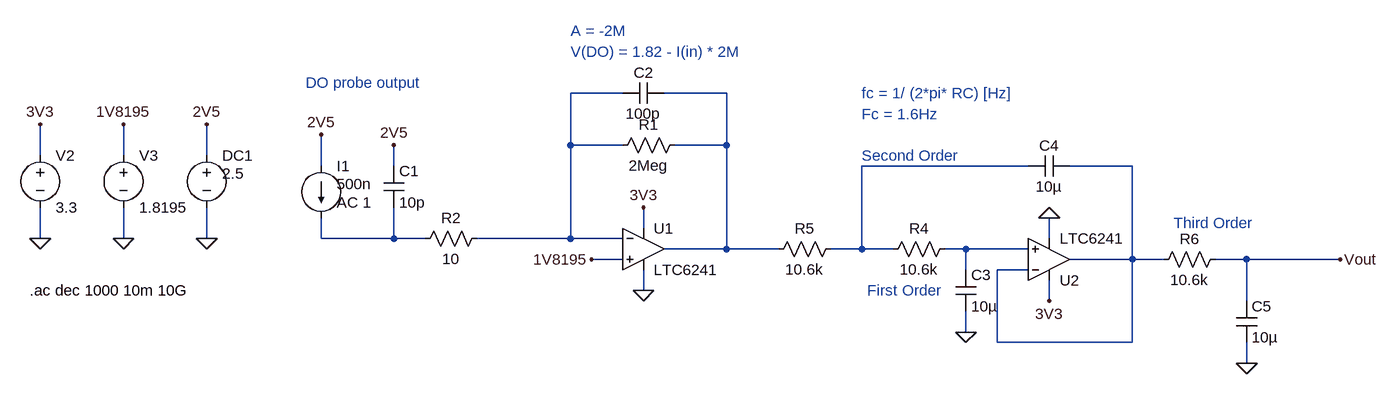
[diagram p0: schematic do_butterworth.asc]
do_butterworth.asc, the LTspice schematic file:
Version 4
SHEET 1 1740 724
WIRE 96 64 16 64
WIRE 256 64 160 64
WIRE 16 144 16 64
WIRE 96 144 16 144
WIRE 256 144 256 64
WIRE 256 144 176 144
WIRE -800 160 -800 112
WIRE -672 160 -672 112
WIRE -544 160 -544 112
WIRE -368 176 -368 128
WIRE -256 176 -256 144
WIRE 720 176 464 176
WIRE 880 176 784 176
WIRE 128 272 128 240
WIRE -800 288 -800 240
WIRE -672 288 -672 240
WIRE -544 288 -544 240
WIRE -368 288 -368 256
WIRE -256 288 -256 240
WIRE -256 288 -368 288
WIRE -208 288 -256 288
WIRE 16 288 16 144
WIRE 16 288 -128 288
WIRE 96 288 16 288
WIRE 752 288 752 256
WIRE 256 304 256 144
WIRE 256 304 160 304
WIRE 336 304 256 304
WIRE 464 304 464 176
WIRE 464 304 416 304
WIRE 512 304 464 304
WIRE 624 304 592 304
WIRE 720 304 624 304
WIRE 96 320 48 320
WIRE 880 320 880 176
WIRE 880 320 784 320
WIRE 928 320 880 320
WIRE 1056 320 1008 320
WIRE 1200 320 1056 320
WIRE 624 336 624 304
WIRE 720 336 672 336
WIRE 128 368 128 336
WIRE 752 384 752 352
WIRE 1056 384 1056 320
WIRE 624 432 624 400
WIRE 672 448 672 336
WIRE 880 448 880 320
WIRE 880 448 672 448
WIRE 1056 480 1056 448
FLAG 128 368 0
FLAG -800 112 3V3
FLAG -800 288 0
FLAG 128 240 3V3
FLAG -672 112 1V8195
FLAG -672 288 0
FLAG 48 320 1V8195
FLAG 752 256 0
FLAG 752 384 3V3
FLAG 624 432 0
FLAG 1056 480 0
FLAG 1200 320 Vout
FLAG -368 128 2V5
FLAG -256 144 2V5
FLAG -544 112 2V5
FLAG -544 288 0
SYMBOL voltage -800 144 R0
WINDOW 123 0 0 Left 0
WINDOW 39 0 0 Left 0
SYMATTR InstName V2
SYMATTR Value 3.3
SYMBOL res 192 128 R90
WINDOW 0 0 56 VBottom 2
WINDOW 3 32 56 VTop 2
SYMATTR InstName R1
SYMATTR Value 2Meg
SYMATTR SpiceLine tol=0.1 pwr=0.25
SYMBOL voltage -672 144 R0
WINDOW 123 0 0 Left 0
WINDOW 39 0 0 Left 0
SYMATTR InstName V3
SYMATTR Value 1.8195
SYMBOL OpAmps\\LTC6241 128 304 R0
SYMATTR InstName U1
SYMBOL OpAmps\\LTC6241 752 320 M180
SYMATTR InstName U2
SYMBOL res 496 320 R270
WINDOW 0 32 56 VTop 2
WINDOW 3 0 56 VBottom 2
SYMATTR InstName R4
SYMATTR Value 10.6k
SYMBOL res 320 320 R270
WINDOW 0 32 56 VTop 2
WINDOW 3 0 56 VBottom 2
SYMATTR InstName R5
SYMATTR Value 10.6k
SYMBOL cap 608 336 R0
SYMATTR InstName C3
SYMATTR Value 10µ
SYMBOL cap 784 160 R90
WINDOW 0 0 32 VBottom 2
WINDOW 3 32 32 VTop 2
SYMATTR InstName C4
SYMATTR Value 10µ
SYMBOL res 1024 304 R90
WINDOW 0 0 56 VBottom 2
WINDOW 3 32 56 VTop 2
SYMATTR InstName R6
SYMATTR Value 10.6k
SYMBOL cap 1040 384 R0
SYMATTR InstName C5
SYMATTR Value 10µ
SYMBOL res -112 272 R90
WINDOW 0 0 56 VBottom 2
WINDOW 3 32 56 VTop 2
SYMATTR InstName R2
SYMATTR Value 10
SYMBOL current -368 176 R0
WINDOW 3 24 28 Left 2
WINDOW 123 24 56 Left 2
WINDOW 39 0 0 Left 0
SYMATTR Value 500n
SYMATTR Value2 AC 1
SYMATTR InstName I1
SYMBOL cap -272 176 R0
SYMATTR InstName C1
SYMATTR Value 10p
SYMATTR SpiceLine V=10
SYMBOL voltage -544 144 R0
WINDOW 123 24 44 Left 2
WINDOW 39 0 0 Left 0
WINDOW 3 24 44 Left 2
SYMATTR Value 2.5
SYMATTR InstName DC1
SYMBOL cap 160 48 R90
WINDOW 0 0 32 VBottom 2
WINDOW 3 32 32 VTop 2
SYMATTR InstName C2
SYMATTR Value 100p
TEXT 16 -32 Left 2 ;A = -2M
TEXT 16 0 Left 2 ;V(DO) = 1.82 - I(in) * 2M
TEXT -816 368 Left 2 !.ac dec 1000 10m 10G
TEXT 464 160 Left 2 ;Second Order
TEXT 472 368 Left 2 ;First Order
TEXT 944 264 Left 2 ;Third Order
TEXT 464 64 Left 2 ;fc = 1/ (2*pi* RC) [Hz]
TEXT 464 96 Left 2 ;Fc = 1.6Hz
TEXT -392 48 Left 2 ;DO probe output

The netlist it stands for:
* do_butterworth.asc
V2 3V3 0 3.3
R1 N002 N001 2Meg tol=0.1 pwr=0.25
V3 1V8195 0 1.8195
XU1 1V8195 N001 3V3 0 N002 LTC6241  ; pins In+ In- V+ V- OUT
XU2 N006 N004 3V3 0 N004 LTC6241  ; pins In+ In- V+ V- OUT
R4 N003 N006 10.6k
R5 N002 N003 10.6k
C3 N006 0 10µ
C4 N004 N003 10µ
R6 Vout N004 10.6k
C5 Vout 0 10µ
R2 N001 N005 10
I1 2V5 N005 500n AC 1
C1 2V5 N005 10p V=10
V§DC1 2V5 0 2.5
C2 N002 N001 100p
* A = -2M
* V(DO) = 1.82 - I(in) * 2M
.ac dec 1000 10m 10G
* Second Order
* First Order
* Third Order
* fc = 1/ (2*pi* RC) [Hz]
* Fc = 1.6Hz
* DO probe output
.lib LTC4.lib
.backanno
.end